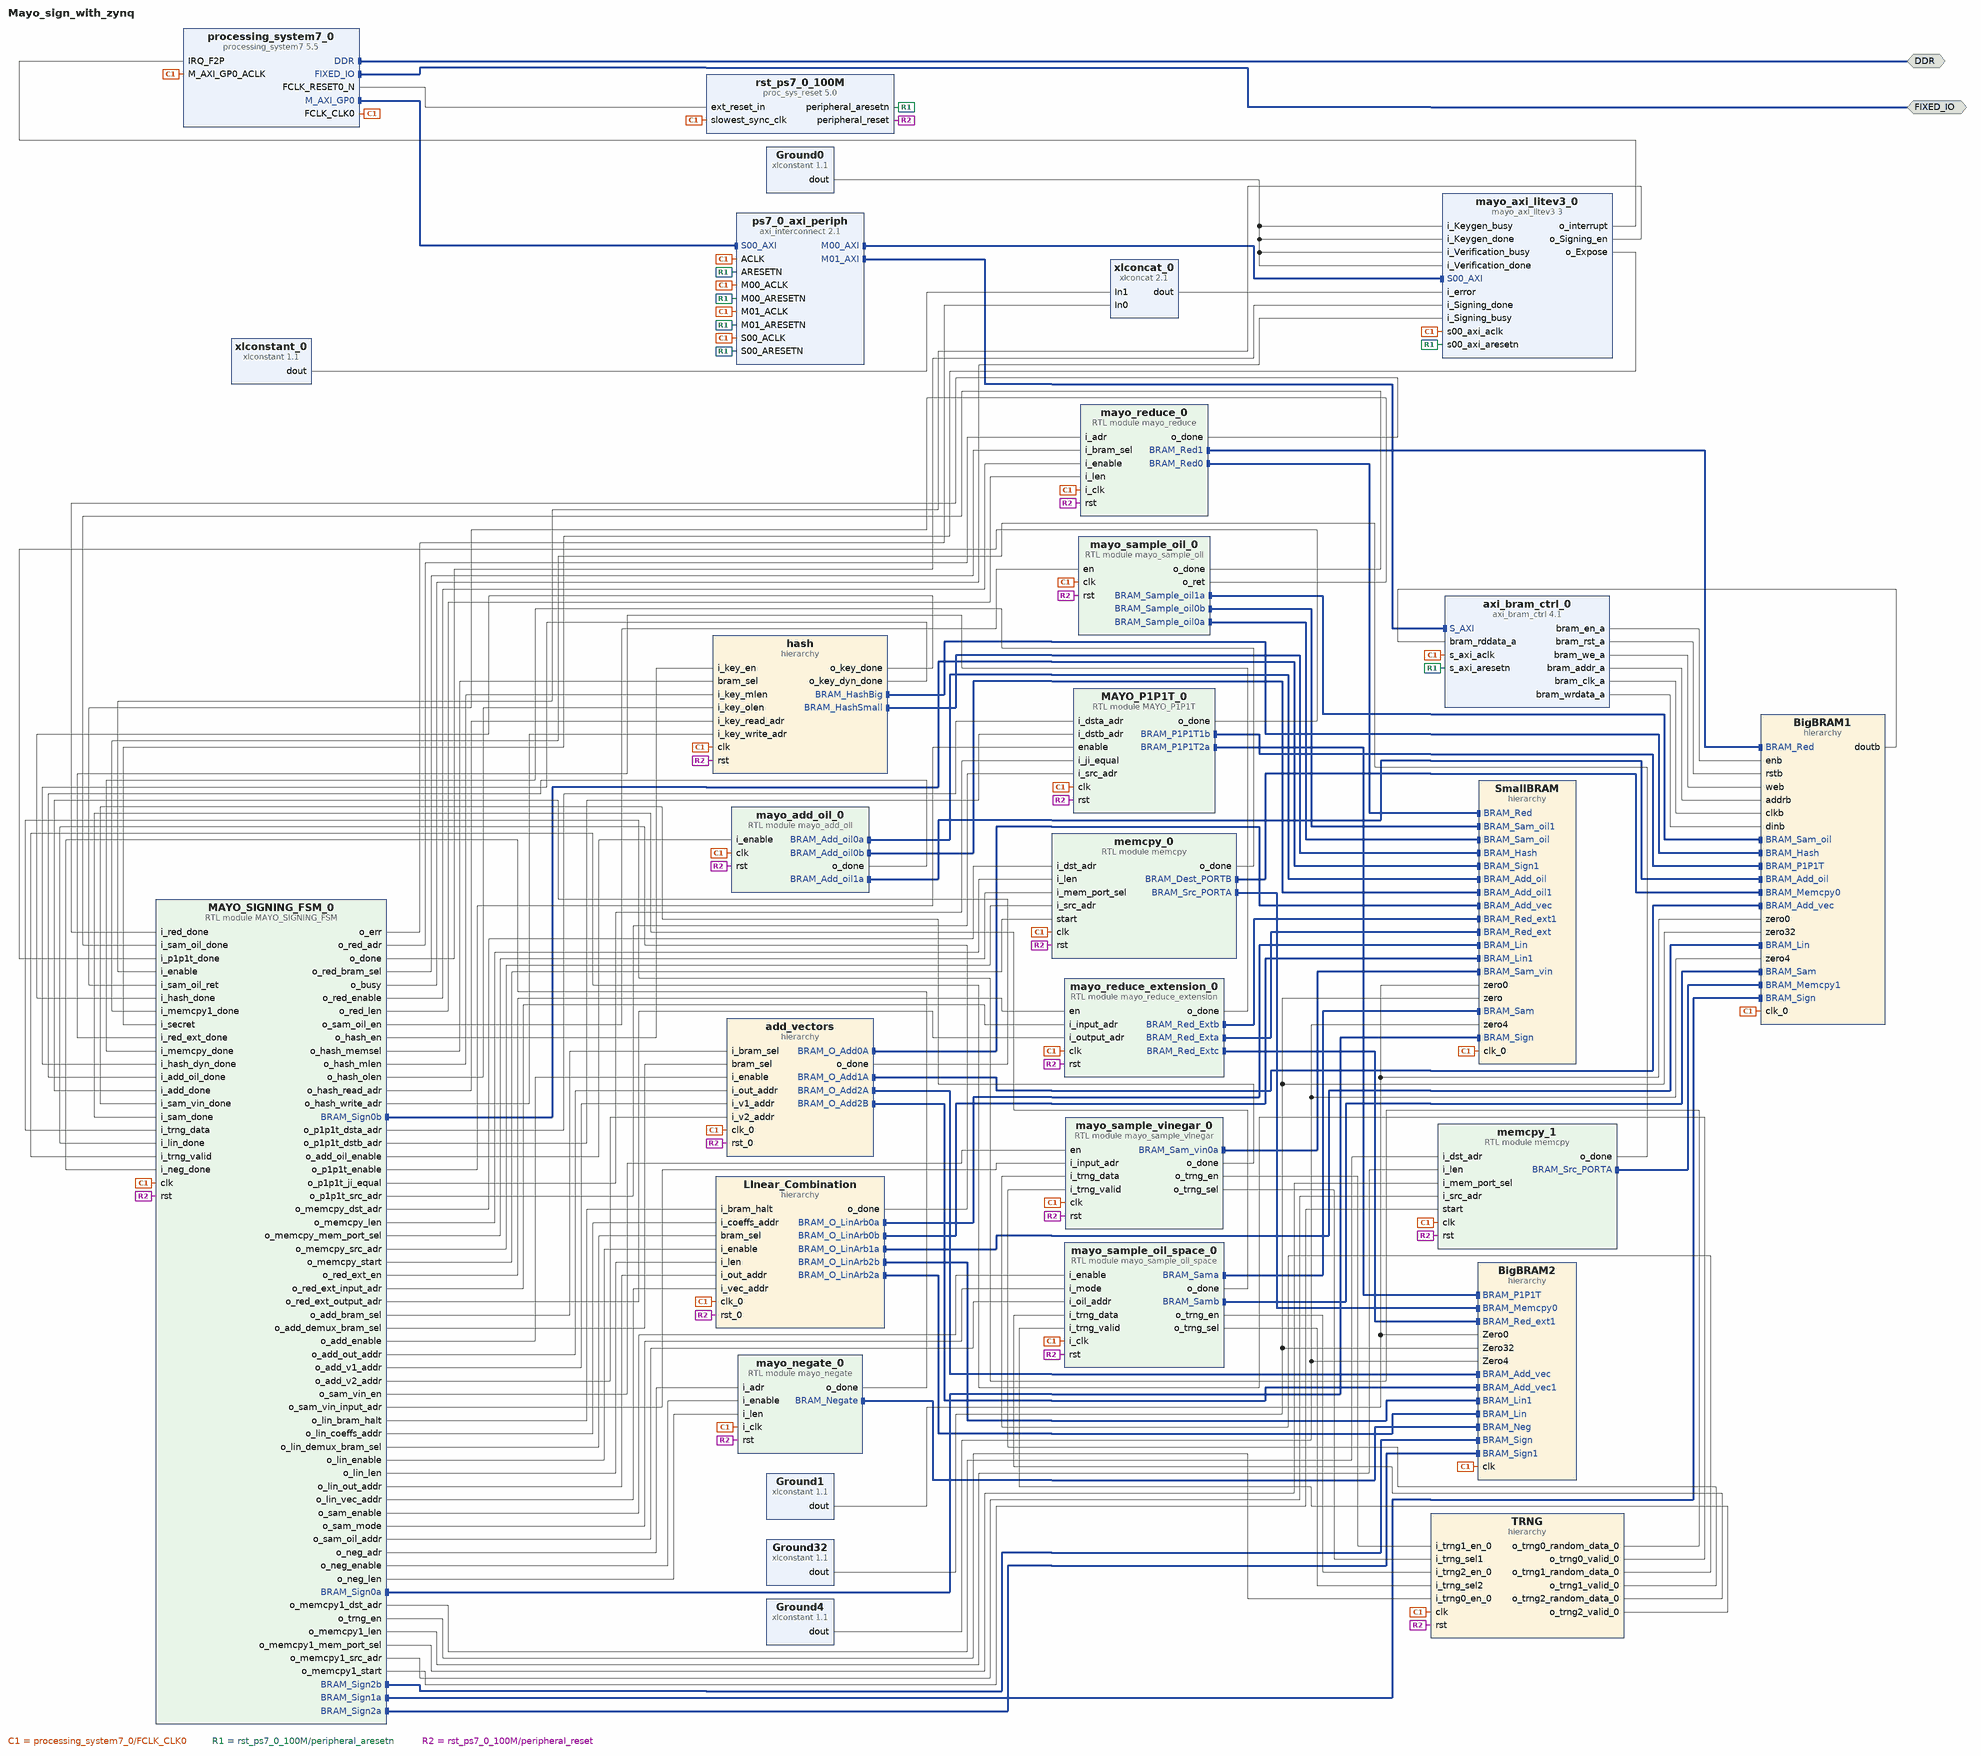
[diagram p0: block diagram of the top level]
# Vivado block design Mayo_sign_with_zynq, xc7z020clg484-1, Vivado 2020.2
create_bd_design Mayo_sign_with_zynq

create_bd_intf_port -mode Master -vlnv xilinx.com:interface:ddrx_rtl:1.0 DDR
create_bd_intf_port -mode Master -vlnv xilinx.com:display_processing_system7:fixedio_rtl:1.0 FIXED_IO

create_bd_cell -type ip -vlnv xilinx.com:ip:xlconstant:1.1 Ground0
set_property -dict {CONFIG.CONST_VAL 0} [get_bd_cells Ground0]
create_bd_cell -type ip -vlnv xilinx.com:ip:processing_system7:5.5 processing_system7_0
set_property -dict [list \
  CONFIG.PCW_APU_PERIPHERAL_FREQMHZ 666.666667 \
  CONFIG.PCW_ENET0_ENET0_IO {MIO 16 .. 27} \
  CONFIG.PCW_ENET0_GRP_MDIO_ENABLE 1 \
  CONFIG.PCW_ENET0_GRP_MDIO_IO {MIO 52 .. 53} \
  CONFIG.PCW_ENET0_PERIPHERAL_ENABLE 1 \
  CONFIG.PCW_ENET0_RESET_ENABLE 0 \
  CONFIG.PCW_ENET_RESET_ENABLE 1 \
  CONFIG.PCW_ENET_RESET_SELECT {Share reset pin} \
  CONFIG.PCW_FPGA0_PERIPHERAL_FREQMHZ 100 \
  CONFIG.PCW_FPGA1_PERIPHERAL_FREQMHZ 150.000000 \
  CONFIG.PCW_GPIO_MIO_GPIO_ENABLE 1 \
  CONFIG.PCW_GPIO_MIO_GPIO_IO MIO \
  CONFIG.PCW_I2C_RESET_ENABLE 1 \
  CONFIG.PCW_IRQ_F2P_INTR 1 \
  CONFIG.PCW_PRESET_BANK1_VOLTAGE {LVCMOS 1.8V} \
  CONFIG.PCW_QSPI_GRP_SINGLE_SS_ENABLE 1 \
  CONFIG.PCW_QSPI_GRP_SINGLE_SS_IO {MIO 1 .. 6} \
  CONFIG.PCW_QSPI_PERIPHERAL_ENABLE 1 \
  CONFIG.PCW_QSPI_QSPI_IO {MIO 1 .. 6} \
  CONFIG.PCW_SD0_GRP_CD_ENABLE 1 \
  CONFIG.PCW_SD0_GRP_CD_IO {MIO 47} \
  CONFIG.PCW_SD0_GRP_WP_ENABLE 1 \
  CONFIG.PCW_SD0_GRP_WP_IO {MIO 46} \
  CONFIG.PCW_SD0_PERIPHERAL_ENABLE 1 \
  CONFIG.PCW_SD0_SD0_IO {MIO 40 .. 45} \
  CONFIG.PCW_SDIO_PERIPHERAL_FREQMHZ 50 \
  CONFIG.PCW_SINGLE_QSPI_DATA_MODE x4 \
  CONFIG.PCW_TTC0_PERIPHERAL_ENABLE 1 \
  CONFIG.PCW_TTC0_TTC0_IO EMIO \
  CONFIG.PCW_UART1_PERIPHERAL_ENABLE 1 \
  CONFIG.PCW_UART1_UART1_IO {MIO 48 .. 49} \
  CONFIG.PCW_UART_PERIPHERAL_FREQMHZ 50 \
  CONFIG.PCW_UIPARAM_DDR_FREQ_MHZ 533.333313 \
  CONFIG.PCW_UIPARAM_DDR_PARTNO {MT41J128M16 HA-15E} \
  CONFIG.PCW_USB0_PERIPHERAL_ENABLE 1 \
  CONFIG.PCW_USB0_RESET_ENABLE 0 \
  CONFIG.PCW_USB0_USB0_IO {MIO 28 .. 39} \
  CONFIG.PCW_USB_RESET_ENABLE 1 \
  CONFIG.PCW_USB_RESET_SELECT {Share reset pin} \
  CONFIG.PCW_USE_FABRIC_INTERRUPT 1 \
  CONFIG.preset ZedBoard \
] [get_bd_cells processing_system7_0]
# 223 more settings of processing_system7_0 are not shown: defaults, MIO pin electricals, DDR timing, and values the tool derives
create_bd_cell -type ip -vlnv user.org:user:mayo_axi_litev3:3 mayo_axi_litev3_0
create_bd_cell -type ip -vlnv xilinx.com:ip:axi_interconnect:2.1 ps7_0_axi_periph
set_property -dict {CONFIG.NUM_MI 2} [get_bd_cells ps7_0_axi_periph]
create_bd_cell -type ip -vlnv xilinx.com:ip:proc_sys_reset:5.0 rst_ps7_0_100M
create_bd_cell -type ip -vlnv xilinx.com:ip:xlconcat:2.1 xlconcat_0
set_property -dict {CONFIG.IN0_WIDTH 2 CONFIG.IN1_WIDTH 6} [get_bd_cells xlconcat_0]
create_bd_cell -type ip -vlnv xilinx.com:ip:xlconstant:1.1 xlconstant_0
set_property -dict {CONFIG.CONST_VAL 0 CONFIG.CONST_WIDTH 6} [get_bd_cells xlconstant_0]
create_bd_cell -type hier BigBRAM1
create_bd_cell -type hier BigBRAM2
create_bd_cell -type ip -vlnv xilinx.com:ip:xlconstant:1.1 Ground1
set_property -dict {CONFIG.CONST_VAL 0} [get_bd_cells Ground1]
create_bd_cell -type ip -vlnv xilinx.com:ip:xlconstant:1.1 Ground32
set_property -dict {CONFIG.CONST_VAL 0x00000000 CONFIG.CONST_WIDTH 32} [get_bd_cells Ground32]
create_bd_cell -type ip -vlnv xilinx.com:ip:xlconstant:1.1 Ground4
set_property -dict {CONFIG.CONST_VAL 0000 CONFIG.CONST_WIDTH 4} [get_bd_cells Ground4]
create_bd_cell -type hier LInear_Combination
create_bd_cell -type module -reference MAYO_P1P1T MAYO_P1P1T_0
create_bd_cell -type module -reference MAYO_SIGNING_FSM MAYO_SIGNING_FSM_0
create_bd_cell -type hier SmallBRAM
create_bd_cell -type hier TRNG
create_bd_cell -type hier add_vectors
create_bd_cell -type hier hash
create_bd_cell -type module -reference mayo_add_oil mayo_add_oil_0
create_bd_cell -type module -reference mayo_negate mayo_negate_0
create_bd_cell -type module -reference mayo_reduce mayo_reduce_0
create_bd_cell -type module -reference mayo_reduce_extension mayo_reduce_extension_0
create_bd_cell -type module -reference mayo_sample_oil mayo_sample_oil_0
create_bd_cell -type module -reference mayo_sample_oil_space mayo_sample_oil_space_0
create_bd_cell -type module -reference memcpy memcpy_0
create_bd_cell -type module -reference memcpy memcpy_1
create_bd_cell -type ip -vlnv xilinx.com:ip:axi_bram_ctrl:4.1 axi_bram_ctrl_0
set_property -dict {CONFIG.SINGLE_PORT_BRAM 1} [get_bd_cells axi_bram_ctrl_0]
create_bd_cell -type module -reference mayo_sample_vinegar mayo_sample_vinegar_0

# ---- hierarchy /BigBRAM1 ----
current_bd_instance /BigBRAM1
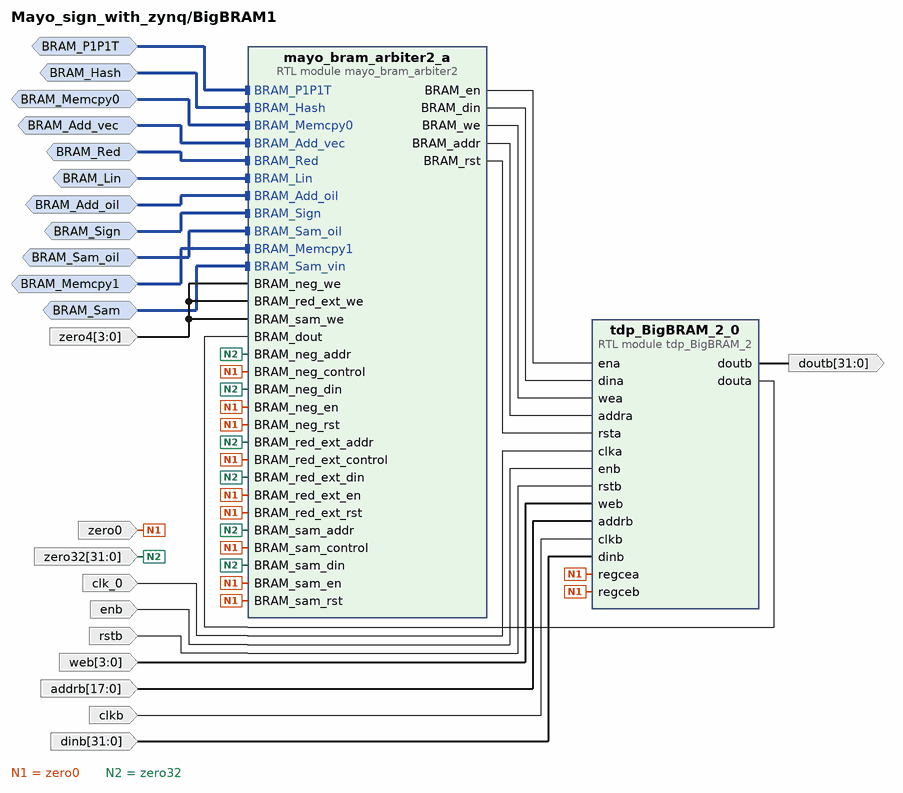
[diagram p1: block diagram inside /BigBRAM1]
create_bd_intf_pin -mode Slave -vlnv MAYO:user:BRAM_BUS_custom_rtl:1.0 BRAM_Sign
create_bd_intf_pin -mode Slave -vlnv MAYO:user:BRAM_BUS_custom_rtl:1.0 BRAM_Add_vec
create_bd_intf_pin -mode Slave -vlnv MAYO:user:BRAM_BUS_custom_rtl:1.0 BRAM_Lin
create_bd_intf_pin -mode Slave -vlnv MAYO:user:BRAM_BUS_custom_rtl:1.0 BRAM_Add_oil
create_bd_intf_pin -mode Slave -vlnv MAYO:user:BRAM_BUS_custom_rtl:1.0 BRAM_P1P1T
create_bd_intf_pin -mode Slave -vlnv MAYO:user:BRAM_BUS_custom_rtl:1.0 BRAM_Sam_oil
create_bd_intf_pin -mode Slave -vlnv MAYO:user:BRAM_BUS_custom_rtl:1.0 BRAM_Red
create_bd_intf_pin -mode Slave -vlnv MAYO:user:BRAM_BUS_custom_rtl:1.0 BRAM_Sam
create_bd_intf_pin -mode Slave -vlnv MAYO:user:BRAM_BUS_custom_rtl:1.0 BRAM_Memcpy0
create_bd_intf_pin -mode Slave -vlnv MAYO:user:BRAM_BUS_custom_rtl:1.0 BRAM_Memcpy1
create_bd_intf_pin -mode Slave -vlnv MAYO:user:BRAM_BUS_custom_rtl:1.0 BRAM_Hash
create_bd_pin -dir I -type clk clk_0
create_bd_pin -dir I zero0
create_bd_pin -dir I -from 3 -to 0 zero4
create_bd_pin -dir I -from 31 -to 0 zero32
create_bd_pin -dir I enb
create_bd_pin -dir I -type rst rstb
create_bd_pin -dir I -from 3 -to 0 web
create_bd_pin -dir I -from 17 -to 0 addrb
create_bd_pin -dir I -type clk clkb
create_bd_pin -dir O -from 31 -to 0 doutb
create_bd_pin -dir I -from 31 -to 0 dinb

create_bd_cell -type module -reference mayo_bram_arbiter2 mayo_bram_arbiter2_a
create_bd_cell -type module -reference tdp_BigBRAM_2 tdp_BigBRAM_2_0

# ---- hierarchy /BigBRAM2 ----
current_bd_instance /BigBRAM2
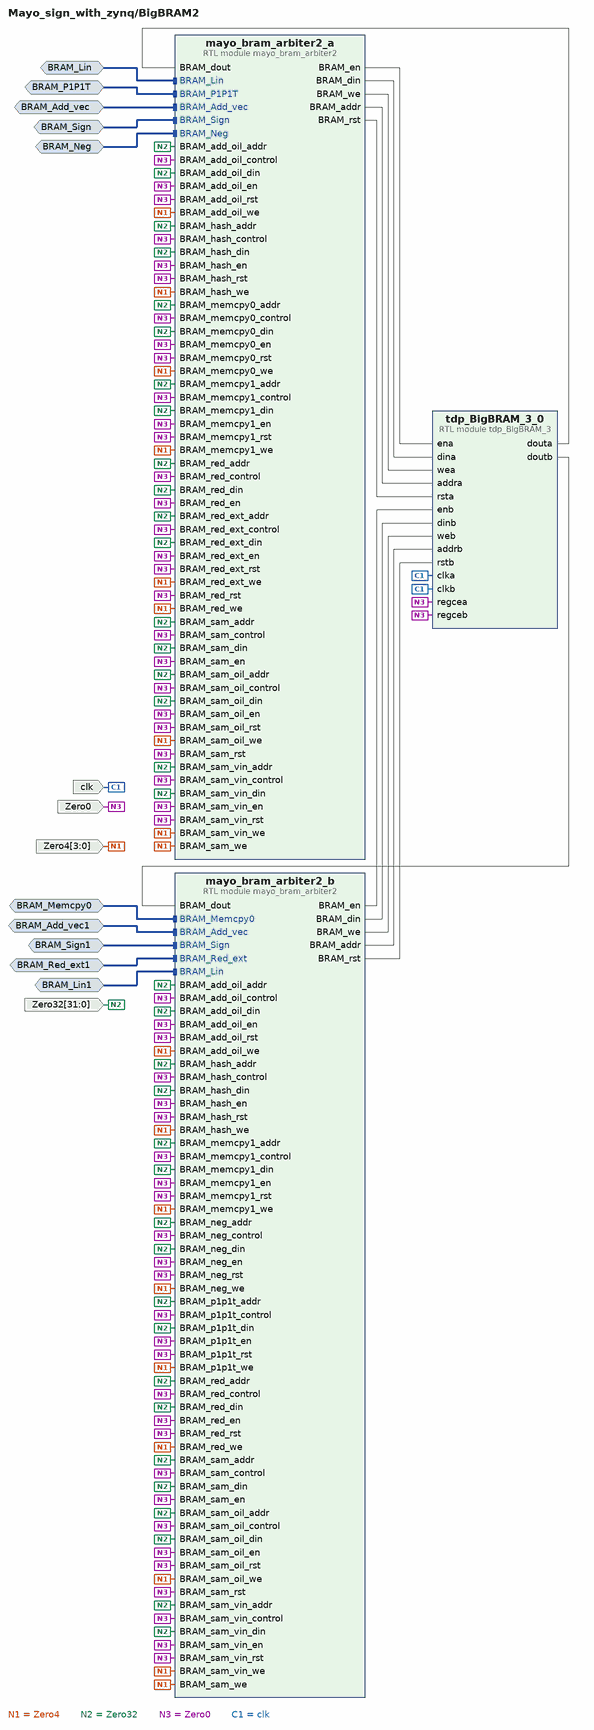
[diagram p2: block diagram inside /BigBRAM2]
create_bd_intf_pin -mode Slave -vlnv MAYO:user:BRAM_BUS_custom_rtl:1.0 BRAM_Lin
create_bd_intf_pin -mode Slave -vlnv MAYO:user:BRAM_BUS_custom_rtl:1.0 BRAM_Lin1
create_bd_intf_pin -mode Slave -vlnv MAYO:user:BRAM_BUS_custom_rtl:1.0 BRAM_Add_vec
create_bd_intf_pin -mode Slave -vlnv MAYO:user:BRAM_BUS_custom_rtl:1.0 BRAM_Add_vec1
create_bd_intf_pin -mode Slave -vlnv MAYO:user:BRAM_BUS_custom_rtl:1.0 BRAM_Sign
create_bd_intf_pin -mode Slave -vlnv MAYO:user:BRAM_BUS_custom_rtl:1.0 BRAM_Sign1
create_bd_intf_pin -mode Slave -vlnv MAYO:user:BRAM_BUS_custom_rtl:1.0 BRAM_Neg
create_bd_intf_pin -mode Slave -vlnv MAYO:user:BRAM_BUS_custom_rtl:1.0 BRAM_Memcpy0
create_bd_intf_pin -mode Slave -vlnv MAYO:user:BRAM_BUS_custom_rtl:1.0 BRAM_Red_ext1
create_bd_intf_pin -mode Slave -vlnv MAYO:user:BRAM_BUS_custom_rtl:1.0 BRAM_P1P1T
create_bd_pin -dir I -type clk clk
create_bd_pin -dir I Zero0
create_bd_pin -dir I -from 3 -to 0 Zero4
create_bd_pin -dir I -from 31 -to 0 Zero32

create_bd_cell -type module -reference mayo_bram_arbiter2 mayo_bram_arbiter2_b
create_bd_cell -type module -reference mayo_bram_arbiter2 mayo_bram_arbiter2_a
create_bd_cell -type module -reference tdp_BigBRAM_3 tdp_BigBRAM_3_0

# ---- hierarchy /LInear_Combination ----
current_bd_instance /LInear_Combination
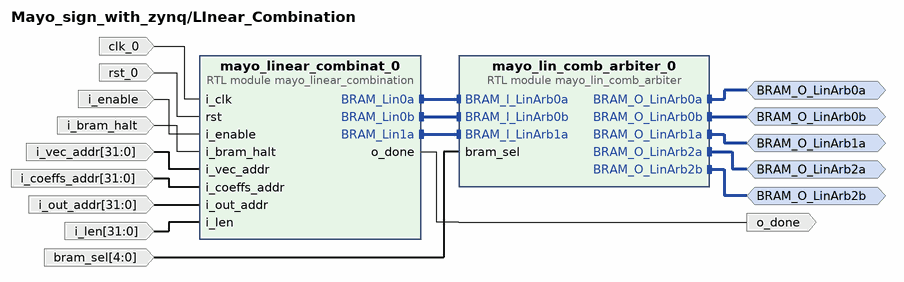
[diagram p3: block diagram inside /LInear_Combination]
create_bd_intf_pin -mode Master -vlnv MAYO:user:BRAM_BUS_custom_rtl:1.0 BRAM_O_LinArb0a
create_bd_intf_pin -mode Master -vlnv MAYO:user:BRAM_BUS_custom_rtl:1.0 BRAM_O_LinArb0b
create_bd_intf_pin -mode Master -vlnv MAYO:user:BRAM_BUS_custom_rtl:1.0 BRAM_O_LinArb1a
create_bd_intf_pin -mode Master -vlnv MAYO:user:BRAM_BUS_custom_rtl:1.0 BRAM_O_LinArb2a
create_bd_intf_pin -mode Master -vlnv MAYO:user:BRAM_BUS_custom_rtl:1.0 BRAM_O_LinArb2b
create_bd_pin -dir I -type clk clk_0
create_bd_pin -dir I -type rst rst_0
create_bd_pin -dir I i_enable
create_bd_pin -dir O o_done
create_bd_pin -dir I i_bram_halt
create_bd_pin -dir I -from 31 -to 0 i_vec_addr
create_bd_pin -dir I -from 31 -to 0 i_coeffs_addr
create_bd_pin -dir I -from 31 -to 0 i_out_addr
create_bd_pin -dir I -from 31 -to 0 i_len
create_bd_pin -dir I -from 4 -to 0 bram_sel

create_bd_cell -type module -reference mayo_lin_comb_arbiter mayo_lin_comb_arbiter_0
create_bd_cell -type module -reference mayo_linear_combination mayo_linear_combinat_0

# ---- hierarchy /SmallBRAM ----
current_bd_instance /SmallBRAM
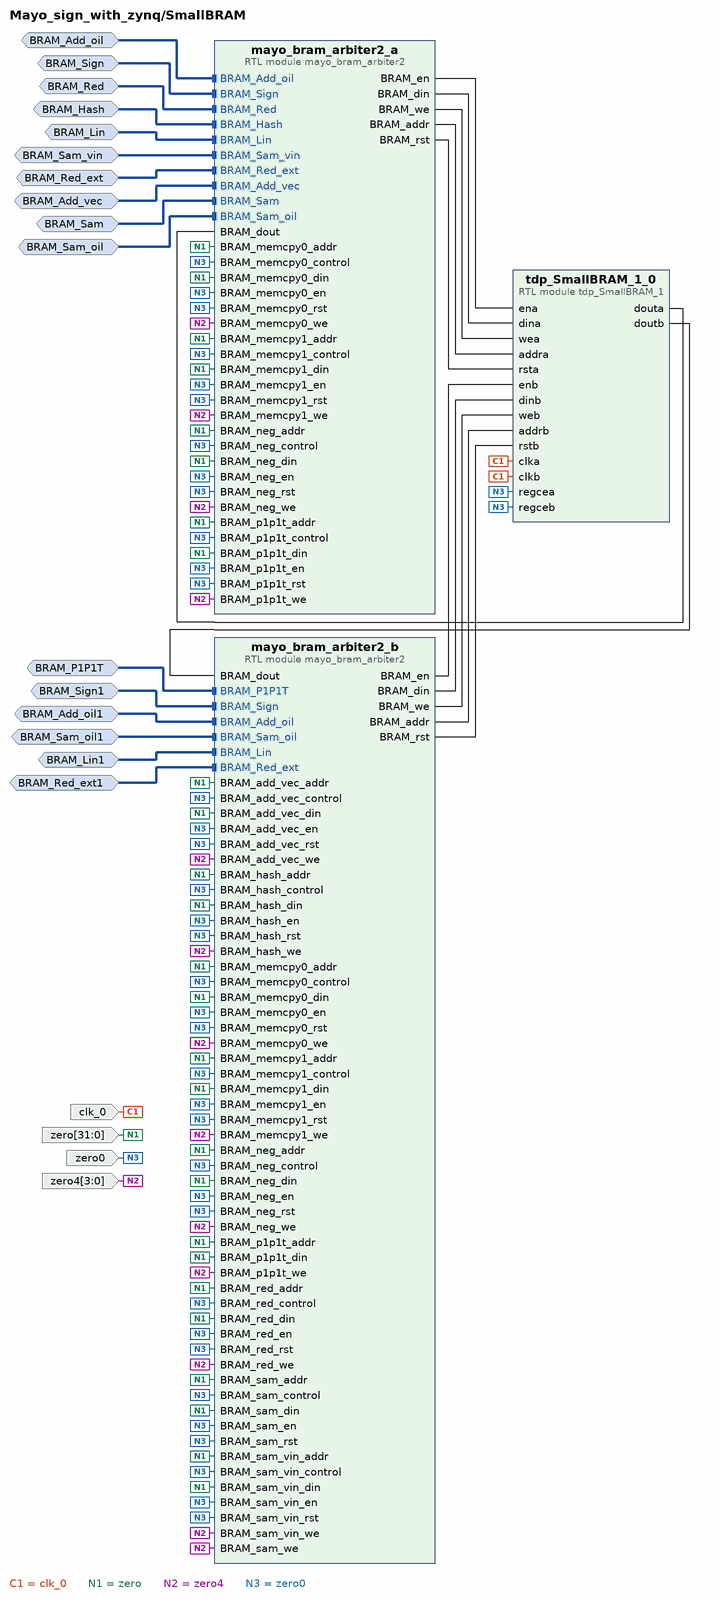
[diagram p4: block diagram inside /SmallBRAM]
create_bd_intf_pin -mode Slave -vlnv MAYO:user:BRAM_BUS_custom_rtl:1.0 BRAM_Sign
create_bd_intf_pin -mode Slave -vlnv MAYO:user:BRAM_BUS_custom_rtl:1.0 BRAM_Add_vec
create_bd_intf_pin -mode Slave -vlnv MAYO:user:BRAM_BUS_custom_rtl:1.0 BRAM_Sign1
create_bd_intf_pin -mode Slave -vlnv MAYO:user:BRAM_BUS_custom_rtl:1.0 BRAM_Lin
create_bd_intf_pin -mode Slave -vlnv MAYO:user:BRAM_BUS_custom_rtl:1.0 BRAM_Lin1
create_bd_intf_pin -mode Slave -vlnv MAYO:user:BRAM_BUS_custom_rtl:1.0 BRAM_Add_oil
create_bd_intf_pin -mode Slave -vlnv MAYO:user:BRAM_BUS_custom_rtl:1.0 BRAM_Add_oil1
create_bd_intf_pin -mode Slave -vlnv MAYO:user:BRAM_BUS_custom_rtl:1.0 BRAM_P1P1T
create_bd_intf_pin -mode Slave -vlnv MAYO:user:BRAM_BUS_custom_rtl:1.0 BRAM_Sam_oil
create_bd_intf_pin -mode Slave -vlnv MAYO:user:BRAM_BUS_custom_rtl:1.0 BRAM_Sam_oil1
create_bd_intf_pin -mode Slave -vlnv MAYO:user:BRAM_BUS_custom_rtl:1.0 BRAM_Sam_vin
create_bd_intf_pin -mode Slave -vlnv MAYO:user:BRAM_BUS_custom_rtl:1.0 BRAM_Red
create_bd_intf_pin -mode Slave -vlnv MAYO:user:BRAM_BUS_custom_rtl:1.0 BRAM_Sam
create_bd_intf_pin -mode Slave -vlnv MAYO:user:BRAM_BUS_custom_rtl:1.0 BRAM_Red_ext
create_bd_intf_pin -mode Slave -vlnv MAYO:user:BRAM_BUS_custom_rtl:1.0 BRAM_Red_ext1
create_bd_intf_pin -mode Slave -vlnv MAYO:user:BRAM_BUS_custom_rtl:1.0 BRAM_Hash
create_bd_pin -dir I -type clk clk_0
create_bd_pin -dir I -from 31 -to 0 zero
create_bd_pin -dir I -from 3 -to 0 zero4
create_bd_pin -dir I zero0

create_bd_cell -type module -reference mayo_bram_arbiter2 mayo_bram_arbiter2_a
create_bd_cell -type module -reference mayo_bram_arbiter2 mayo_bram_arbiter2_b
create_bd_cell -type module -reference tdp_SmallBRAM_1 tdp_SmallBRAM_1_0

# ---- hierarchy /TRNG ----
current_bd_instance /TRNG
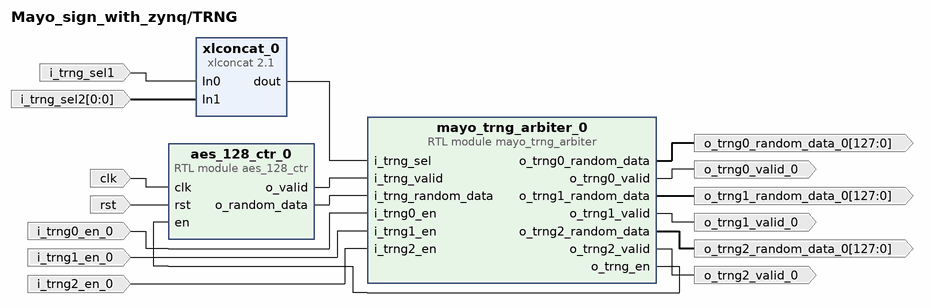
[diagram p5: block diagram inside /TRNG]
create_bd_pin -dir I clk
create_bd_pin -dir I rst
create_bd_pin -dir I i_trng_sel1
create_bd_pin -dir I -from 0 -to 0 i_trng_sel2
create_bd_pin -dir I i_trng0_en_0
create_bd_pin -dir I i_trng1_en_0
create_bd_pin -dir I i_trng2_en_0
create_bd_pin -dir O -from 127 -to 0 o_trng0_random_data_0
create_bd_pin -dir O o_trng0_valid_0
create_bd_pin -dir O -from 127 -to 0 o_trng1_random_data_0
create_bd_pin -dir O o_trng1_valid_0
create_bd_pin -dir O -from 127 -to 0 o_trng2_random_data_0
create_bd_pin -dir O o_trng2_valid_0

create_bd_cell -type ip -vlnv xilinx.com:ip:xlconcat:2.1 xlconcat_0
create_bd_cell -type module -reference mayo_trng_arbiter mayo_trng_arbiter_0
create_bd_cell -type module -reference aes_128_ctr aes_128_ctr_0

# ---- hierarchy /add_vectors ----
current_bd_instance /add_vectors
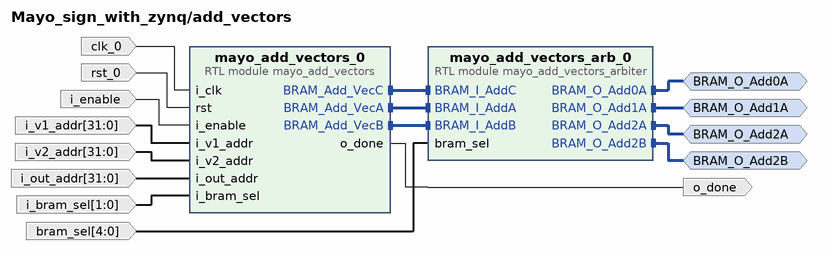
[diagram p6: block diagram inside /add_vectors]
create_bd_intf_pin -mode Master -vlnv MAYO:user:BRAM_BUS_custom_rtl:1.0 BRAM_O_Add0A
create_bd_intf_pin -mode Master -vlnv MAYO:user:BRAM_BUS_custom_rtl:1.0 BRAM_O_Add1A
create_bd_intf_pin -mode Master -vlnv MAYO:user:BRAM_BUS_custom_rtl:1.0 BRAM_O_Add2A
create_bd_intf_pin -mode Master -vlnv MAYO:user:BRAM_BUS_custom_rtl:1.0 BRAM_O_Add2B
create_bd_pin -dir I -type clk clk_0
create_bd_pin -dir I -type rst rst_0
create_bd_pin -dir I i_enable
create_bd_pin -dir I -from 31 -to 0 i_v1_addr
create_bd_pin -dir I -from 31 -to 0 i_v2_addr
create_bd_pin -dir I -from 31 -to 0 i_out_addr
create_bd_pin -dir I -from 1 -to 0 i_bram_sel
create_bd_pin -dir O o_done
create_bd_pin -dir I -from 4 -to 0 bram_sel

create_bd_cell -type module -reference mayo_add_vectors mayo_add_vectors_0
create_bd_cell -type module -reference mayo_add_vectors_arbiter mayo_add_vectors_arb_0

# ---- hierarchy /hash ----
current_bd_instance /hash
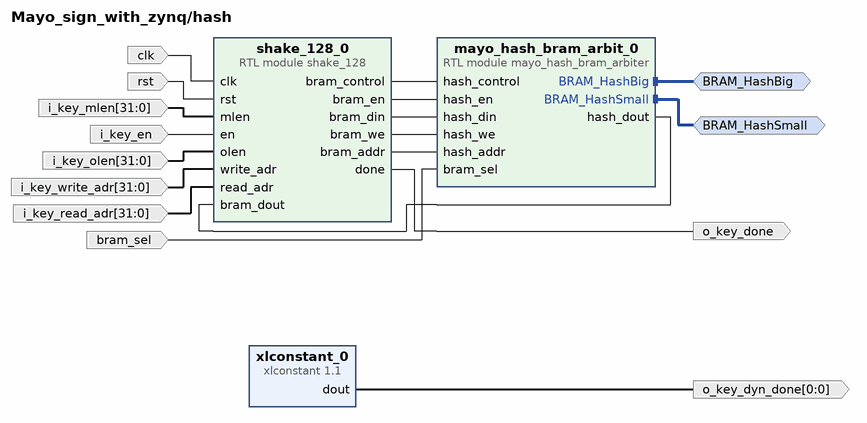
[diagram p7: block diagram inside /hash]
create_bd_intf_pin -mode Master -vlnv MAYO:user:BRAM_BUS_custom_rtl:1.0 BRAM_HashSmall
create_bd_intf_pin -mode Master -vlnv MAYO:user:BRAM_BUS_custom_rtl:1.0 BRAM_HashBig
create_bd_pin -dir I -type clk clk
create_bd_pin -dir I -type rst rst
create_bd_pin -dir I i_key_en
create_bd_pin -dir I -from 31 -to 0 i_key_mlen
create_bd_pin -dir I -from 31 -to 0 i_key_olen
create_bd_pin -dir I -from 31 -to 0 i_key_write_adr
create_bd_pin -dir I -from 31 -to 0 i_key_read_adr
create_bd_pin -dir O o_key_done
create_bd_pin -dir O -from 0 -to 0 o_key_dyn_done
create_bd_pin -dir I bram_sel

create_bd_cell -type module -reference mayo_hash_bram_arbiter mayo_hash_bram_arbit_0
create_bd_cell -type ip -vlnv xilinx.com:ip:xlconstant:1.1 xlconstant_0
set_property -dict {CONFIG.CONST_VAL 0} [get_bd_cells xlconstant_0]
create_bd_cell -type module -reference shake_128 shake_128_0

# ---- connections ----

current_bd_instance /BigBRAM1
connect_bd_intf_net [get_bd_intf_pins BRAM_P1P1T] [get_bd_intf_pins mayo_bram_arbiter2_a/BRAM_P1P1T]
connect_bd_intf_net [get_bd_intf_pins BRAM_Hash] [get_bd_intf_pins mayo_bram_arbiter2_a/BRAM_Hash]
connect_bd_intf_net [get_bd_intf_pins BRAM_Memcpy0] [get_bd_intf_pins mayo_bram_arbiter2_a/BRAM_Memcpy0]
connect_bd_intf_net [get_bd_intf_pins BRAM_Add_vec] [get_bd_intf_pins mayo_bram_arbiter2_a/BRAM_Add_vec]
connect_bd_intf_net [get_bd_intf_pins BRAM_Red] [get_bd_intf_pins mayo_bram_arbiter2_a/BRAM_Red]
connect_bd_intf_net [get_bd_intf_pins BRAM_Lin] [get_bd_intf_pins mayo_bram_arbiter2_a/BRAM_Lin]
connect_bd_intf_net [get_bd_intf_pins BRAM_Add_oil] [get_bd_intf_pins mayo_bram_arbiter2_a/BRAM_Add_oil]
connect_bd_intf_net [get_bd_intf_pins BRAM_Sign] [get_bd_intf_pins mayo_bram_arbiter2_a/BRAM_Sign]
connect_bd_intf_net [get_bd_intf_pins BRAM_Sam_oil] [get_bd_intf_pins mayo_bram_arbiter2_a/BRAM_Sam_oil]
connect_bd_intf_net [get_bd_intf_pins BRAM_Memcpy1] [get_bd_intf_pins mayo_bram_arbiter2_a/BRAM_Memcpy1]
connect_bd_intf_net [get_bd_intf_pins BRAM_Sam] [get_bd_intf_pins mayo_bram_arbiter2_a/BRAM_Sam_vin]
connect_bd_net [get_bd_pins mayo_bram_arbiter2_a/BRAM_en] [get_bd_pins tdp_BigBRAM_2_0/ena]
connect_bd_net [get_bd_pins tdp_BigBRAM_2_0/douta] [get_bd_pins mayo_bram_arbiter2_a/BRAM_dout]
connect_bd_net [get_bd_pins mayo_bram_arbiter2_a/BRAM_din] [get_bd_pins tdp_BigBRAM_2_0/dina]
connect_bd_net [get_bd_pins mayo_bram_arbiter2_a/BRAM_we] [get_bd_pins tdp_BigBRAM_2_0/wea]
connect_bd_net [get_bd_pins mayo_bram_arbiter2_a/BRAM_addr] [get_bd_pins tdp_BigBRAM_2_0/addra]
connect_bd_net [get_bd_pins mayo_bram_arbiter2_a/BRAM_rst] [get_bd_pins tdp_BigBRAM_2_0/rsta]
connect_bd_net -net zero0_1 [get_bd_pins zero0] \
  [get_bd_pins tdp_BigBRAM_2_0/regcea] [get_bd_pins tdp_BigBRAM_2_0/regceb] [get_bd_pins mayo_bram_arbiter2_a/BRAM_neg_en] \
  [get_bd_pins mayo_bram_arbiter2_a/BRAM_neg_rst] [get_bd_pins mayo_bram_arbiter2_a/BRAM_neg_control] \
  [get_bd_pins mayo_bram_arbiter2_a/BRAM_sam_en] [get_bd_pins mayo_bram_arbiter2_a/BRAM_sam_rst] \
  [get_bd_pins mayo_bram_arbiter2_a/BRAM_sam_control] [get_bd_pins mayo_bram_arbiter2_a/BRAM_red_ext_en] \
  [get_bd_pins mayo_bram_arbiter2_a/BRAM_red_ext_control] [get_bd_pins mayo_bram_arbiter2_a/BRAM_red_ext_rst]
connect_bd_net -net zero4_1 [get_bd_pins zero4] \
  [get_bd_pins mayo_bram_arbiter2_a/BRAM_neg_we] [get_bd_pins mayo_bram_arbiter2_a/BRAM_sam_we] \
  [get_bd_pins mayo_bram_arbiter2_a/BRAM_red_ext_we]
connect_bd_net -net zero32_1 [get_bd_pins zero32] \
  [get_bd_pins mayo_bram_arbiter2_a/BRAM_neg_din] [get_bd_pins mayo_bram_arbiter2_a/BRAM_neg_addr] \
  [get_bd_pins mayo_bram_arbiter2_a/BRAM_sam_din] [get_bd_pins mayo_bram_arbiter2_a/BRAM_sam_addr] \
  [get_bd_pins mayo_bram_arbiter2_a/BRAM_red_ext_addr] [get_bd_pins mayo_bram_arbiter2_a/BRAM_red_ext_din]
connect_bd_net -net clk_0_1 [get_bd_pins clk_0] [get_bd_pins tdp_BigBRAM_2_0/clka]
connect_bd_net [get_bd_pins enb] [get_bd_pins tdp_BigBRAM_2_0/enb]
connect_bd_net [get_bd_pins rstb] [get_bd_pins tdp_BigBRAM_2_0/rstb]
connect_bd_net [get_bd_pins web] [get_bd_pins tdp_BigBRAM_2_0/web]
connect_bd_net [get_bd_pins addrb] [get_bd_pins tdp_BigBRAM_2_0/addrb]
connect_bd_net [get_bd_pins clkb] [get_bd_pins tdp_BigBRAM_2_0/clkb]
connect_bd_net [get_bd_pins tdp_BigBRAM_2_0/doutb] [get_bd_pins doutb]
connect_bd_net [get_bd_pins dinb] [get_bd_pins tdp_BigBRAM_2_0/dinb]

current_bd_instance /BigBRAM2
connect_bd_intf_net [get_bd_intf_pins BRAM_Lin] [get_bd_intf_pins mayo_bram_arbiter2_a/BRAM_Lin]
connect_bd_intf_net [get_bd_intf_pins BRAM_P1P1T] [get_bd_intf_pins mayo_bram_arbiter2_a/BRAM_P1P1T]
connect_bd_intf_net [get_bd_intf_pins BRAM_Add_vec] [get_bd_intf_pins mayo_bram_arbiter2_a/BRAM_Add_vec]
connect_bd_intf_net [get_bd_intf_pins BRAM_Memcpy0] [get_bd_intf_pins mayo_bram_arbiter2_b/BRAM_Memcpy0]
connect_bd_intf_net [get_bd_intf_pins BRAM_Add_vec1] [get_bd_intf_pins mayo_bram_arbiter2_b/BRAM_Add_vec]
connect_bd_intf_net [get_bd_intf_pins BRAM_Sign1] [get_bd_intf_pins mayo_bram_arbiter2_b/BRAM_Sign]
connect_bd_intf_net [get_bd_intf_pins BRAM_Sign] [get_bd_intf_pins mayo_bram_arbiter2_a/BRAM_Sign]
connect_bd_intf_net [get_bd_intf_pins BRAM_Red_ext1] [get_bd_intf_pins mayo_bram_arbiter2_b/BRAM_Red_ext]
connect_bd_intf_net [get_bd_intf_pins BRAM_Neg] [get_bd_intf_pins mayo_bram_arbiter2_a/BRAM_Neg]
connect_bd_intf_net [get_bd_intf_pins BRAM_Lin1] [get_bd_intf_pins mayo_bram_arbiter2_b/BRAM_Lin]
connect_bd_net -net BRAM_neg_we1_1 [get_bd_pins Zero4] \
  [get_bd_pins mayo_bram_arbiter2_b/BRAM_neg_we] [get_bd_pins mayo_bram_arbiter2_b/BRAM_red_we] \
  [get_bd_pins mayo_bram_arbiter2_b/BRAM_sam_we] [get_bd_pins mayo_bram_arbiter2_b/BRAM_memcpy1_we] \
  [get_bd_pins mayo_bram_arbiter2_b/BRAM_p1p1t_we] [get_bd_pins mayo_bram_arbiter2_b/BRAM_sam_vin_we] \
  [get_bd_pins mayo_bram_arbiter2_b/BRAM_sam_oil_we] [get_bd_pins mayo_bram_arbiter2_b/BRAM_add_oil_we] \
  [get_bd_pins mayo_bram_arbiter2_b/BRAM_hash_we] [get_bd_pins mayo_bram_arbiter2_a/BRAM_red_we] \
  [get_bd_pins mayo_bram_arbiter2_a/BRAM_sam_we] [get_bd_pins mayo_bram_arbiter2_a/BRAM_memcpy0_we] \
  [get_bd_pins mayo_bram_arbiter2_a/BRAM_memcpy1_we] [get_bd_pins mayo_bram_arbiter2_a/BRAM_red_ext_we] \
  [get_bd_pins mayo_bram_arbiter2_a/BRAM_sam_vin_we] [get_bd_pins mayo_bram_arbiter2_a/BRAM_sam_oil_we] \
  [get_bd_pins mayo_bram_arbiter2_a/BRAM_add_oil_we] [get_bd_pins mayo_bram_arbiter2_a/BRAM_hash_we]
connect_bd_net -net BRAM_neg_din1_1 [get_bd_pins Zero32] \
  [get_bd_pins mayo_bram_arbiter2_b/BRAM_neg_din] [get_bd_pins mayo_bram_arbiter2_b/BRAM_neg_addr] \
  [get_bd_pins mayo_bram_arbiter2_b/BRAM_red_din] [get_bd_pins mayo_bram_arbiter2_b/BRAM_red_addr] \
  [get_bd_pins mayo_bram_arbiter2_b/BRAM_sam_din] [get_bd_pins mayo_bram_arbiter2_b/BRAM_sam_addr] \
  [get_bd_pins mayo_bram_arbiter2_b/BRAM_memcpy1_din] [get_bd_pins mayo_bram_arbiter2_b/BRAM_memcpy1_addr] \
  [get_bd_pins mayo_bram_arbiter2_b/BRAM_p1p1t_din] [get_bd_pins mayo_bram_arbiter2_b/BRAM_p1p1t_addr] \
  [get_bd_pins mayo_bram_arbiter2_b/BRAM_sam_vin_din] [get_bd_pins mayo_bram_arbiter2_b/BRAM_sam_vin_addr] \
  [get_bd_pins mayo_bram_arbiter2_b/BRAM_sam_oil_din] [get_bd_pins mayo_bram_arbiter2_b/BRAM_sam_oil_addr] \
  [get_bd_pins mayo_bram_arbiter2_b/BRAM_add_oil_din] [get_bd_pins mayo_bram_arbiter2_b/BRAM_add_oil_addr] \
  [get_bd_pins mayo_bram_arbiter2_b/BRAM_hash_din] [get_bd_pins mayo_bram_arbiter2_b/BRAM_hash_addr] \
  [get_bd_pins mayo_bram_arbiter2_a/BRAM_red_din] [get_bd_pins mayo_bram_arbiter2_a/BRAM_red_addr] \
  [get_bd_pins mayo_bram_arbiter2_a/BRAM_sam_din] [get_bd_pins mayo_bram_arbiter2_a/BRAM_sam_addr] \
  [get_bd_pins mayo_bram_arbiter2_a/BRAM_memcpy0_din] [get_bd_pins mayo_bram_arbiter2_a/BRAM_memcpy0_addr] \
  [get_bd_pins mayo_bram_arbiter2_a/BRAM_memcpy1_din] [get_bd_pins mayo_bram_arbiter2_a/BRAM_memcpy1_addr] \
  [get_bd_pins mayo_bram_arbiter2_a/BRAM_red_ext_din] [get_bd_pins mayo_bram_arbiter2_a/BRAM_red_ext_addr] \
  [get_bd_pins mayo_bram_arbiter2_a/BRAM_sam_vin_din] [get_bd_pins mayo_bram_arbiter2_a/BRAM_sam_vin_addr] \
  [get_bd_pins mayo_bram_arbiter2_a/BRAM_sam_oil_din] [get_bd_pins mayo_bram_arbiter2_a/BRAM_sam_oil_addr] \
  [get_bd_pins mayo_bram_arbiter2_a/BRAM_add_oil_din] [get_bd_pins mayo_bram_arbiter2_a/BRAM_add_oil_addr] \
  [get_bd_pins mayo_bram_arbiter2_a/BRAM_hash_din] [get_bd_pins mayo_bram_arbiter2_a/BRAM_hash_addr]
connect_bd_net -net BRAM_neg_en1_1 [get_bd_pins Zero0] \
  [get_bd_pins mayo_bram_arbiter2_b/BRAM_neg_en] [get_bd_pins mayo_bram_arbiter2_b/BRAM_neg_rst] \
  [get_bd_pins mayo_bram_arbiter2_b/BRAM_neg_control] [get_bd_pins mayo_bram_arbiter2_b/BRAM_red_en] \
  [get_bd_pins mayo_bram_arbiter2_b/BRAM_red_rst] [get_bd_pins mayo_bram_arbiter2_b/BRAM_red_control] \
  [get_bd_pins mayo_bram_arbiter2_b/BRAM_sam_en] [get_bd_pins mayo_bram_arbiter2_b/BRAM_sam_rst] \
  [get_bd_pins mayo_bram_arbiter2_b/BRAM_sam_control] [get_bd_pins mayo_bram_arbiter2_b/BRAM_memcpy1_en] \
  [get_bd_pins mayo_bram_arbiter2_b/BRAM_memcpy1_rst] [get_bd_pins mayo_bram_arbiter2_b/BRAM_memcpy1_control] \
  [get_bd_pins mayo_bram_arbiter2_b/BRAM_p1p1t_en] [get_bd_pins mayo_bram_arbiter2_b/BRAM_p1p1t_rst] \
  [get_bd_pins mayo_bram_arbiter2_b/BRAM_p1p1t_control] [get_bd_pins mayo_bram_arbiter2_b/BRAM_sam_vin_en] \
  [get_bd_pins mayo_bram_arbiter2_b/BRAM_sam_vin_rst] [get_bd_pins mayo_bram_arbiter2_b/BRAM_sam_vin_control] \
  [get_bd_pins mayo_bram_arbiter2_b/BRAM_sam_oil_en] [get_bd_pins mayo_bram_arbiter2_b/BRAM_sam_oil_rst] \
  [get_bd_pins mayo_bram_arbiter2_b/BRAM_sam_oil_control] [get_bd_pins mayo_bram_arbiter2_b/BRAM_add_oil_en] \
  [get_bd_pins mayo_bram_arbiter2_b/BRAM_add_oil_rst] [get_bd_pins mayo_bram_arbiter2_b/BRAM_add_oil_control] \
  [get_bd_pins mayo_bram_arbiter2_b/BRAM_hash_en] [get_bd_pins mayo_bram_arbiter2_b/BRAM_hash_rst] \
  [get_bd_pins mayo_bram_arbiter2_b/BRAM_hash_control] [get_bd_pins mayo_bram_arbiter2_a/BRAM_red_en] \
  [get_bd_pins mayo_bram_arbiter2_a/BRAM_red_rst] [get_bd_pins mayo_bram_arbiter2_a/BRAM_red_control] \
  [get_bd_pins mayo_bram_arbiter2_a/BRAM_sam_en] [get_bd_pins mayo_bram_arbiter2_a/BRAM_sam_rst] \
  [get_bd_pins mayo_bram_arbiter2_a/BRAM_sam_control] [get_bd_pins mayo_bram_arbiter2_a/BRAM_memcpy0_en] \
  [get_bd_pins mayo_bram_arbiter2_a/BRAM_memcpy0_rst] [get_bd_pins mayo_bram_arbiter2_a/BRAM_memcpy0_control] \
  [get_bd_pins mayo_bram_arbiter2_a/BRAM_memcpy1_en] [get_bd_pins mayo_bram_arbiter2_a/BRAM_memcpy1_rst] \
  [get_bd_pins mayo_bram_arbiter2_a/BRAM_memcpy1_control] [get_bd_pins mayo_bram_arbiter2_a/BRAM_red_ext_en] \
  [get_bd_pins mayo_bram_arbiter2_a/BRAM_red_ext_rst] [get_bd_pins mayo_bram_arbiter2_a/BRAM_red_ext_control] \
  [get_bd_pins mayo_bram_arbiter2_a/BRAM_sam_vin_en] [get_bd_pins mayo_bram_arbiter2_a/BRAM_sam_vin_rst] \
  [get_bd_pins mayo_bram_arbiter2_a/BRAM_sam_vin_control] [get_bd_pins mayo_bram_arbiter2_a/BRAM_sam_oil_en] \
  [get_bd_pins mayo_bram_arbiter2_a/BRAM_sam_oil_rst] [get_bd_pins mayo_bram_arbiter2_a/BRAM_sam_oil_control] \
  [get_bd_pins mayo_bram_arbiter2_a/BRAM_add_oil_en] [get_bd_pins mayo_bram_arbiter2_a/BRAM_add_oil_rst] \
  [get_bd_pins mayo_bram_arbiter2_a/BRAM_add_oil_control] [get_bd_pins mayo_bram_arbiter2_a/BRAM_hash_en] \
  [get_bd_pins mayo_bram_arbiter2_a/BRAM_hash_rst] [get_bd_pins mayo_bram_arbiter2_a/BRAM_hash_control] \
  [get_bd_pins tdp_BigBRAM_3_0/regcea] [get_bd_pins tdp_BigBRAM_3_0/regceb]
connect_bd_net [get_bd_pins mayo_bram_arbiter2_a/BRAM_en] [get_bd_pins tdp_BigBRAM_3_0/ena]
connect_bd_net [get_bd_pins tdp_BigBRAM_3_0/douta] [get_bd_pins mayo_bram_arbiter2_a/BRAM_dout]
connect_bd_net [get_bd_pins mayo_bram_arbiter2_a/BRAM_din] [get_bd_pins tdp_BigBRAM_3_0/dina]
connect_bd_net [get_bd_pins mayo_bram_arbiter2_a/BRAM_we] [get_bd_pins tdp_BigBRAM_3_0/wea]
connect_bd_net [get_bd_pins mayo_bram_arbiter2_a/BRAM_addr] [get_bd_pins tdp_BigBRAM_3_0/addra]
connect_bd_net [get_bd_pins mayo_bram_arbiter2_a/BRAM_rst] [get_bd_pins tdp_BigBRAM_3_0/rsta]
connect_bd_net [get_bd_pins mayo_bram_arbiter2_b/BRAM_en] [get_bd_pins tdp_BigBRAM_3_0/enb]
connect_bd_net [get_bd_pins tdp_BigBRAM_3_0/doutb] [get_bd_pins mayo_bram_arbiter2_b/BRAM_dout]
connect_bd_net [get_bd_pins mayo_bram_arbiter2_b/BRAM_din] [get_bd_pins tdp_BigBRAM_3_0/dinb]
connect_bd_net [get_bd_pins mayo_bram_arbiter2_b/BRAM_we] [get_bd_pins tdp_BigBRAM_3_0/web]
connect_bd_net [get_bd_pins mayo_bram_arbiter2_b/BRAM_addr] [get_bd_pins tdp_BigBRAM_3_0/addrb]
connect_bd_net [get_bd_pins mayo_bram_arbiter2_b/BRAM_rst] [get_bd_pins tdp_BigBRAM_3_0/rstb]
connect_bd_net [get_bd_pins clk] [get_bd_pins tdp_BigBRAM_3_0/clka] [get_bd_pins tdp_BigBRAM_3_0/clkb]

current_bd_instance /LInear_Combination
connect_bd_intf_net [get_bd_intf_pins mayo_linear_combinat_0/BRAM_Lin0a] [get_bd_intf_pins mayo_lin_comb_arbiter_0/BRAM_I_LinArb0a]
connect_bd_intf_net [get_bd_intf_pins mayo_linear_combinat_0/BRAM_Lin0b] [get_bd_intf_pins mayo_lin_comb_arbiter_0/BRAM_I_LinArb0b]
connect_bd_intf_net [get_bd_intf_pins BRAM_O_LinArb0b] [get_bd_intf_pins mayo_lin_comb_arbiter_0/BRAM_O_LinArb0b]
connect_bd_intf_net [get_bd_intf_pins mayo_linear_combinat_0/BRAM_Lin1a] [get_bd_intf_pins mayo_lin_comb_arbiter_0/BRAM_I_LinArb1a]
connect_bd_intf_net [get_bd_intf_pins BRAM_O_LinArb2a] [get_bd_intf_pins mayo_lin_comb_arbiter_0/BRAM_O_LinArb2a]
connect_bd_intf_net [get_bd_intf_pins BRAM_O_LinArb0a] [get_bd_intf_pins mayo_lin_comb_arbiter_0/BRAM_O_LinArb0a]
connect_bd_intf_net [get_bd_intf_pins BRAM_O_LinArb2b] [get_bd_intf_pins mayo_lin_comb_arbiter_0/BRAM_O_LinArb2b]
connect_bd_intf_net [get_bd_intf_pins BRAM_O_LinArb1a] [get_bd_intf_pins mayo_lin_comb_arbiter_0/BRAM_O_LinArb1a]
connect_bd_net -net clk_0_1 [get_bd_pins clk_0] [get_bd_pins mayo_linear_combinat_0/i_clk]
connect_bd_net -net rst_0_1 [get_bd_pins rst_0] [get_bd_pins mayo_linear_combinat_0/rst]
connect_bd_net -net MAYO_SIGNING_FSM_0_o_lin_enable [get_bd_pins i_enable] [get_bd_pins mayo_linear_combinat_0/i_enable]
connect_bd_net [get_bd_pins mayo_linear_combinat_0/o_done] [get_bd_pins o_done]
connect_bd_net -net MAYO_SIGNING_FSM_0_o_lin_bram_halt [get_bd_pins i_bram_halt] [get_bd_pins mayo_linear_combinat_0/i_bram_halt]
connect_bd_net -net MAYO_SIGNING_FSM_0_o_lin_vec_addr [get_bd_pins i_vec_addr] [get_bd_pins mayo_linear_combinat_0/i_vec_addr]
connect_bd_net -net MAYO_SIGNING_FSM_0_o_lin_coeffs_addr [get_bd_pins i_coeffs_addr] [get_bd_pins mayo_linear_combinat_0/i_coeffs_addr]
connect_bd_net -net MAYO_SIGNING_FSM_0_o_lin_out_addr [get_bd_pins i_out_addr] [get_bd_pins mayo_linear_combinat_0/i_out_addr]
connect_bd_net -net MAYO_SIGNING_FSM_0_o_lin_len [get_bd_pins i_len] [get_bd_pins mayo_linear_combinat_0/i_len]
connect_bd_net [get_bd_pins bram_sel] [get_bd_pins mayo_lin_comb_arbiter_0/bram_sel]

current_bd_instance /SmallBRAM
connect_bd_intf_net [get_bd_intf_pins BRAM_P1P1T] [get_bd_intf_pins mayo_bram_arbiter2_b/BRAM_P1P1T]
connect_bd_intf_net [get_bd_intf_pins BRAM_Add_oil] [get_bd_intf_pins mayo_bram_arbiter2_a/BRAM_Add_oil]
connect_bd_intf_net [get_bd_intf_pins BRAM_Sign] [get_bd_intf_pins mayo_bram_arbiter2_a/BRAM_Sign]
connect_bd_intf_net [get_bd_intf_pins BRAM_Red] [get_bd_intf_pins mayo_bram_arbiter2_a/BRAM_Red]
connect_bd_intf_net [get_bd_intf_pins BRAM_Hash] [get_bd_intf_pins mayo_bram_arbiter2_a/BRAM_Hash]
connect_bd_intf_net [get_bd_intf_pins BRAM_Sign1] [get_bd_intf_pins mayo_bram_arbiter2_b/BRAM_Sign]
connect_bd_intf_net [get_bd_intf_pins BRAM_Lin] [get_bd_intf_pins mayo_bram_arbiter2_a/BRAM_Lin]
connect_bd_intf_net [get_bd_intf_pins BRAM_Sam_vin] [get_bd_intf_pins mayo_bram_arbiter2_a/BRAM_Sam_vin]
connect_bd_intf_net [get_bd_intf_pins BRAM_Red_ext] [get_bd_intf_pins mayo_bram_arbiter2_a/BRAM_Red_ext]
connect_bd_intf_net [get_bd_intf_pins BRAM_Add_oil1] [get_bd_intf_pins mayo_bram_arbiter2_b/BRAM_Add_oil]
connect_bd_intf_net [get_bd_intf_pins BRAM_Sam_oil1] [get_bd_intf_pins mayo_bram_arbiter2_b/BRAM_Sam_oil]
connect_bd_intf_net [get_bd_intf_pins BRAM_Add_vec] [get_bd_intf_pins mayo_bram_arbiter2_a/BRAM_Add_vec]
connect_bd_intf_net [get_bd_intf_pins BRAM_Sam] [get_bd_intf_pins mayo_bram_arbiter2_a/BRAM_Sam]
connect_bd_intf_net [get_bd_intf_pins BRAM_Lin1] [get_bd_intf_pins mayo_bram_arbiter2_b/BRAM_Lin]
connect_bd_intf_net [get_bd_intf_pins BRAM_Red_ext1] [get_bd_intf_pins mayo_bram_arbiter2_b/BRAM_Red_ext]
connect_bd_intf_net [get_bd_intf_pins BRAM_Sam_oil] [get_bd_intf_pins mayo_bram_arbiter2_a/BRAM_Sam_oil]
connect_bd_net -net clk_0_1 [get_bd_pins clk_0] [get_bd_pins tdp_SmallBRAM_1_0/clka] [get_bd_pins tdp_SmallBRAM_1_0/clkb]
connect_bd_net -net BRAM_add_vec_din1_1 [get_bd_pins zero] \
  [get_bd_pins mayo_bram_arbiter2_a/BRAM_neg_din] [get_bd_pins mayo_bram_arbiter2_a/BRAM_neg_addr] \
  [get_bd_pins mayo_bram_arbiter2_a/BRAM_memcpy0_din] [get_bd_pins mayo_bram_arbiter2_a/BRAM_memcpy0_addr] \
  [get_bd_pins mayo_bram_arbiter2_a/BRAM_memcpy1_din] [get_bd_pins mayo_bram_arbiter2_a/BRAM_memcpy1_addr] \
  [get_bd_pins mayo_bram_arbiter2_a/BRAM_p1p1t_din] [get_bd_pins mayo_bram_arbiter2_a/BRAM_p1p1t_addr] \
  [get_bd_pins mayo_bram_arbiter2_b/BRAM_add_vec_din] [get_bd_pins mayo_bram_arbiter2_b/BRAM_add_vec_addr] \
  [get_bd_pins mayo_bram_arbiter2_b/BRAM_neg_din] [get_bd_pins mayo_bram_arbiter2_b/BRAM_neg_addr] \
  [get_bd_pins mayo_bram_arbiter2_b/BRAM_red_din] [get_bd_pins mayo_bram_arbiter2_b/BRAM_red_addr] \
  [get_bd_pins mayo_bram_arbiter2_b/BRAM_sam_din] [get_bd_pins mayo_bram_arbiter2_b/BRAM_sam_addr] \
  [get_bd_pins mayo_bram_arbiter2_b/BRAM_memcpy0_din] [get_bd_pins mayo_bram_arbiter2_b/BRAM_memcpy0_addr] \
  [get_bd_pins mayo_bram_arbiter2_b/BRAM_memcpy1_din] [get_bd_pins mayo_bram_arbiter2_b/BRAM_memcpy1_addr] \
  [get_bd_pins mayo_bram_arbiter2_b/BRAM_p1p1t_din] [get_bd_pins mayo_bram_arbiter2_b/BRAM_p1p1t_addr] \
  [get_bd_pins mayo_bram_arbiter2_b/BRAM_sam_vin_din] [get_bd_pins mayo_bram_arbiter2_b/BRAM_sam_vin_addr] \
  [get_bd_pins mayo_bram_arbiter2_b/BRAM_hash_din] [get_bd_pins mayo_bram_arbiter2_b/BRAM_hash_addr]
connect_bd_net -net BRAM_neg_we_1 [get_bd_pins zero4] \
  [get_bd_pins mayo_bram_arbiter2_a/BRAM_neg_we] [get_bd_pins mayo_bram_arbiter2_a/BRAM_memcpy0_we] \
  [get_bd_pins mayo_bram_arbiter2_a/BRAM_memcpy1_we] [get_bd_pins mayo_bram_arbiter2_a/BRAM_p1p1t_we] \
  [get_bd_pins mayo_bram_arbiter2_b/BRAM_add_vec_we] [get_bd_pins mayo_bram_arbiter2_b/BRAM_neg_we] \
  [get_bd_pins mayo_bram_arbiter2_b/BRAM_red_we] [get_bd_pins mayo_bram_arbiter2_b/BRAM_sam_we] \
  [get_bd_pins mayo_bram_arbiter2_b/BRAM_memcpy0_we] [get_bd_pins mayo_bram_arbiter2_b/BRAM_memcpy1_we] \
  [get_bd_pins mayo_bram_arbiter2_b/BRAM_p1p1t_we] [get_bd_pins mayo_bram_arbiter2_b/BRAM_sam_vin_we] \
  [get_bd_pins mayo_bram_arbiter2_b/BRAM_hash_we]
connect_bd_net -net BRAM_add_vec_en1_1 [get_bd_pins zero0] \
  [get_bd_pins mayo_bram_arbiter2_a/BRAM_neg_en] [get_bd_pins mayo_bram_arbiter2_a/BRAM_neg_rst] \
  [get_bd_pins mayo_bram_arbiter2_a/BRAM_neg_control] [get_bd_pins mayo_bram_arbiter2_a/BRAM_memcpy0_en] \
  [get_bd_pins mayo_bram_arbiter2_a/BRAM_memcpy0_rst] [get_bd_pins mayo_bram_arbiter2_a/BRAM_memcpy0_control] \
  [get_bd_pins mayo_bram_arbiter2_a/BRAM_memcpy1_en] [get_bd_pins mayo_bram_arbiter2_a/BRAM_memcpy1_rst] \
  [get_bd_pins mayo_bram_arbiter2_a/BRAM_memcpy1_control] [get_bd_pins mayo_bram_arbiter2_a/BRAM_p1p1t_en] \
  [get_bd_pins mayo_bram_arbiter2_a/BRAM_p1p1t_rst] [get_bd_pins mayo_bram_arbiter2_a/BRAM_p1p1t_control] \
  [get_bd_pins mayo_bram_arbiter2_b/BRAM_add_vec_en] [get_bd_pins mayo_bram_arbiter2_b/BRAM_add_vec_rst] \
  [get_bd_pins mayo_bram_arbiter2_b/BRAM_add_vec_control] [get_bd_pins mayo_bram_arbiter2_b/BRAM_neg_en] \
  [get_bd_pins mayo_bram_arbiter2_b/BRAM_neg_rst] [get_bd_pins mayo_bram_arbiter2_b/BRAM_neg_control] \
  [get_bd_pins mayo_bram_arbiter2_b/BRAM_red_en] [get_bd_pins mayo_bram_arbiter2_b/BRAM_red_rst] \
  [get_bd_pins mayo_bram_arbiter2_b/BRAM_red_control] [get_bd_pins mayo_bram_arbiter2_b/BRAM_sam_en] \
  [get_bd_pins mayo_bram_arbiter2_b/BRAM_sam_rst] [get_bd_pins mayo_bram_arbiter2_b/BRAM_sam_control] \
  [get_bd_pins mayo_bram_arbiter2_b/BRAM_memcpy0_en] [get_bd_pins mayo_bram_arbiter2_b/BRAM_memcpy0_rst] \
  [get_bd_pins mayo_bram_arbiter2_b/BRAM_memcpy0_control] [get_bd_pins mayo_bram_arbiter2_b/BRAM_memcpy1_en] \
  [get_bd_pins mayo_bram_arbiter2_b/BRAM_memcpy1_rst] [get_bd_pins mayo_bram_arbiter2_b/BRAM_memcpy1_control] \
  [get_bd_pins mayo_bram_arbiter2_b/BRAM_sam_vin_en] [get_bd_pins mayo_bram_arbiter2_b/BRAM_sam_vin_rst] \
  [get_bd_pins mayo_bram_arbiter2_b/BRAM_sam_vin_control] [get_bd_pins mayo_bram_arbiter2_b/BRAM_hash_en] \
  [get_bd_pins mayo_bram_arbiter2_b/BRAM_hash_rst] [get_bd_pins mayo_bram_arbiter2_b/BRAM_hash_control] \
  [get_bd_pins tdp_SmallBRAM_1_0/regcea] [get_bd_pins tdp_SmallBRAM_1_0/regceb]
connect_bd_net [get_bd_pins mayo_bram_arbiter2_a/BRAM_en] [get_bd_pins tdp_SmallBRAM_1_0/ena]
connect_bd_net [get_bd_pins tdp_SmallBRAM_1_0/douta] [get_bd_pins mayo_bram_arbiter2_a/BRAM_dout]
connect_bd_net [get_bd_pins mayo_bram_arbiter2_a/BRAM_din] [get_bd_pins tdp_SmallBRAM_1_0/dina]
connect_bd_net [get_bd_pins mayo_bram_arbiter2_a/BRAM_we] [get_bd_pins tdp_SmallBRAM_1_0/wea]
connect_bd_net [get_bd_pins mayo_bram_arbiter2_a/BRAM_addr] [get_bd_pins tdp_SmallBRAM_1_0/addra]
connect_bd_net [get_bd_pins mayo_bram_arbiter2_a/BRAM_rst] [get_bd_pins tdp_SmallBRAM_1_0/rsta]
connect_bd_net [get_bd_pins mayo_bram_arbiter2_b/BRAM_en] [get_bd_pins tdp_SmallBRAM_1_0/enb]
connect_bd_net [get_bd_pins tdp_SmallBRAM_1_0/doutb] [get_bd_pins mayo_bram_arbiter2_b/BRAM_dout]
connect_bd_net [get_bd_pins mayo_bram_arbiter2_b/BRAM_din] [get_bd_pins tdp_SmallBRAM_1_0/dinb]
connect_bd_net [get_bd_pins mayo_bram_arbiter2_b/BRAM_we] [get_bd_pins tdp_SmallBRAM_1_0/web]
connect_bd_net [get_bd_pins mayo_bram_arbiter2_b/BRAM_addr] [get_bd_pins tdp_SmallBRAM_1_0/addrb]
connect_bd_net [get_bd_pins mayo_bram_arbiter2_b/BRAM_rst] [get_bd_pins tdp_SmallBRAM_1_0/rstb]

current_bd_instance /TRNG
connect_bd_net [get_bd_pins i_trng_sel1] [get_bd_pins xlconcat_0/In0]
connect_bd_net -net In1_1 [get_bd_pins i_trng_sel2] [get_bd_pins xlconcat_0/In1]
connect_bd_net [get_bd_pins xlconcat_0/dout] [get_bd_pins mayo_trng_arbiter_0/i_trng_sel]
connect_bd_net -net i_trng0_en_0_1 [get_bd_pins i_trng0_en_0] [get_bd_pins mayo_trng_arbiter_0/i_trng0_en]
connect_bd_net -net i_trng1_en_0_1 [get_bd_pins i_trng1_en_0] [get_bd_pins mayo_trng_arbiter_0/i_trng1_en]
connect_bd_net -net i_trng2_en_0_1 [get_bd_pins i_trng2_en_0] [get_bd_pins mayo_trng_arbiter_0/i_trng2_en]
connect_bd_net [get_bd_pins mayo_trng_arbiter_0/o_trng0_random_data] [get_bd_pins o_trng0_random_data_0]
connect_bd_net [get_bd_pins mayo_trng_arbiter_0/o_trng0_valid] [get_bd_pins o_trng0_valid_0]
connect_bd_net [get_bd_pins mayo_trng_arbiter_0/o_trng1_random_data] [get_bd_pins o_trng1_random_data_0]
connect_bd_net [get_bd_pins mayo_trng_arbiter_0/o_trng1_valid] [get_bd_pins o_trng1_valid_0]
connect_bd_net [get_bd_pins mayo_trng_arbiter_0/o_trng2_random_data] [get_bd_pins o_trng2_random_data_0]
connect_bd_net [get_bd_pins mayo_trng_arbiter_0/o_trng2_valid] [get_bd_pins o_trng2_valid_0]
connect_bd_net [get_bd_pins clk] [get_bd_pins aes_128_ctr_0/clk]
connect_bd_net [get_bd_pins rst] [get_bd_pins aes_128_ctr_0/rst]
connect_bd_net [get_bd_pins mayo_trng_arbiter_0/o_trng_en] [get_bd_pins aes_128_ctr_0/en]
connect_bd_net [get_bd_pins aes_128_ctr_0/o_valid] [get_bd_pins mayo_trng_arbiter_0/i_trng_valid]
connect_bd_net [get_bd_pins aes_128_ctr_0/o_random_data] [get_bd_pins mayo_trng_arbiter_0/i_trng_random_data]

current_bd_instance /add_vectors
connect_bd_intf_net [get_bd_intf_pins mayo_add_vectors_0/BRAM_Add_VecC] [get_bd_intf_pins mayo_add_vectors_arb_0/BRAM_I_AddC]
connect_bd_intf_net [get_bd_intf_pins BRAM_O_Add2B] [get_bd_intf_pins mayo_add_vectors_arb_0/BRAM_O_Add2B]
connect_bd_intf_net [get_bd_intf_pins mayo_add_vectors_0/BRAM_Add_VecA] [get_bd_intf_pins mayo_add_vectors_arb_0/BRAM_I_AddA]
connect_bd_intf_net [get_bd_intf_pins BRAM_O_Add2A] [get_bd_intf_pins mayo_add_vectors_arb_0/BRAM_O_Add2A]
connect_bd_intf_net [get_bd_intf_pins BRAM_O_Add1A] [get_bd_intf_pins mayo_add_vectors_arb_0/BRAM_O_Add1A]
connect_bd_intf_net [get_bd_intf_pins mayo_add_vectors_0/BRAM_Add_VecB] [get_bd_intf_pins mayo_add_vectors_arb_0/BRAM_I_AddB]
connect_bd_intf_net [get_bd_intf_pins BRAM_O_Add0A] [get_bd_intf_pins mayo_add_vectors_arb_0/BRAM_O_Add0A]
connect_bd_net -net clk_0_1 [get_bd_pins clk_0] [get_bd_pins mayo_add_vectors_0/i_clk]
connect_bd_net -net rst_0_1 [get_bd_pins rst_0] [get_bd_pins mayo_add_vectors_0/rst]
connect_bd_net -net MAYO_SIGNING_FSM_0_o_add_enable [get_bd_pins i_enable] [get_bd_pins mayo_add_vectors_0/i_enable]
connect_bd_net -net MAYO_SIGNING_FSM_0_o_add_v1_addr [get_bd_pins i_v1_addr] [get_bd_pins mayo_add_vectors_0/i_v1_addr]
connect_bd_net -net MAYO_SIGNING_FSM_0_o_add_v2_addr [get_bd_pins i_v2_addr] [get_bd_pins mayo_add_vectors_0/i_v2_addr]
connect_bd_net -net MAYO_SIGNING_FSM_0_o_add_out_addr [get_bd_pins i_out_addr] [get_bd_pins mayo_add_vectors_0/i_out_addr]
connect_bd_net -net MAYO_SIGNING_FSM_0_o_add_bram_sel [get_bd_pins i_bram_sel] [get_bd_pins mayo_add_vectors_0/i_bram_sel]
connect_bd_net [get_bd_pins mayo_add_vectors_0/o_done] [get_bd_pins o_done]
connect_bd_net [get_bd_pins bram_sel] [get_bd_pins mayo_add_vectors_arb_0/bram_sel]

current_bd_instance /hash
connect_bd_intf_net [get_bd_intf_pins BRAM_HashBig] [get_bd_intf_pins mayo_hash_bram_arbit_0/BRAM_HashBig]
connect_bd_intf_net [get_bd_intf_pins BRAM_HashSmall] [get_bd_intf_pins mayo_hash_bram_arbit_0/BRAM_HashSmall]
connect_bd_net [get_bd_pins bram_sel] [get_bd_pins mayo_hash_bram_arbit_0/bram_sel]
connect_bd_net [get_bd_pins clk] [get_bd_pins shake_128_0/clk]
connect_bd_net [get_bd_pins rst] [get_bd_pins shake_128_0/rst]
connect_bd_net [get_bd_pins shake_128_0/bram_control] [get_bd_pins mayo_hash_bram_arbit_0/hash_control]
connect_bd_net [get_bd_pins shake_128_0/bram_en] [get_bd_pins mayo_hash_bram_arbit_0/hash_en]
connect_bd_net [get_bd_pins mayo_hash_bram_arbit_0/hash_dout] [get_bd_pins shake_128_0/bram_dout]
connect_bd_net [get_bd_pins shake_128_0/bram_din] [get_bd_pins mayo_hash_bram_arbit_0/hash_din]
connect_bd_net [get_bd_pins shake_128_0/bram_we] [get_bd_pins mayo_hash_bram_arbit_0/hash_we]
connect_bd_net [get_bd_pins shake_128_0/bram_addr] [get_bd_pins mayo_hash_bram_arbit_0/hash_addr]
connect_bd_net [get_bd_pins shake_128_0/done] [get_bd_pins o_key_done]
connect_bd_net [get_bd_pins xlconstant_0/dout] [get_bd_pins o_key_dyn_done]
connect_bd_net [get_bd_pins i_key_mlen] [get_bd_pins shake_128_0/mlen]
connect_bd_net [get_bd_pins i_key_en] [get_bd_pins shake_128_0/en]
connect_bd_net [get_bd_pins i_key_olen] [get_bd_pins shake_128_0/olen]
connect_bd_net [get_bd_pins i_key_write_adr] [get_bd_pins shake_128_0/write_adr]
connect_bd_net [get_bd_pins i_key_read_adr] [get_bd_pins shake_128_0/read_adr]

current_bd_instance /
connect_bd_intf_net [get_bd_intf_pins hash/BRAM_HashSmall] [get_bd_intf_pins SmallBRAM/BRAM_Hash]
connect_bd_intf_net [get_bd_intf_pins MAYO_SIGNING_FSM_0/BRAM_Sign0b] [get_bd_intf_pins SmallBRAM/BRAM_Sign1]
connect_bd_intf_net [get_bd_intf_pins mayo_add_oil_0/BRAM_Add_oil0a] [get_bd_intf_pins SmallBRAM/BRAM_Add_oil]
connect_bd_intf_net [get_bd_intf_pins MAYO_P1P1T_0/BRAM_P1P1T2a] [get_bd_intf_pins BigBRAM2/BRAM_P1P1T]
connect_bd_intf_net [get_bd_intf_pins mayo_sample_oil_space_0/BRAM_Sama] [get_bd_intf_pins SmallBRAM/BRAM_Sam]
connect_bd_intf_net [get_bd_intf_pins mayo_negate_0/BRAM_Negate] [get_bd_intf_pins BigBRAM2/BRAM_Neg]
connect_bd_intf_net [get_bd_intf_pins mayo_reduce_extension_0/BRAM_Red_Extb] [get_bd_intf_pins SmallBRAM/BRAM_Red_ext1]
connect_bd_intf_net [get_bd_intf_pins MAYO_SIGNING_FSM_0/BRAM_Sign1a] [get_bd_intf_pins BigBRAM1/BRAM_Sign]
connect_bd_intf_net [get_bd_intf_pins mayo_sample_oil_0/BRAM_Sample_oil0b] [get_bd_intf_pins SmallBRAM/BRAM_Sam_oil1]
connect_bd_intf_net [get_bd_intf_pins hash/BRAM_HashBig] [get_bd_intf_pins BigBRAM1/BRAM_Hash]
connect_bd_intf_net [get_bd_intf_pins mayo_sample_vinegar_0/BRAM_Sam_vin0a] [get_bd_intf_pins SmallBRAM/BRAM_Sam_vin]
connect_bd_intf_net [get_bd_intf_pins MAYO_SIGNING_FSM_0/BRAM_Sign2b] [get_bd_intf_pins BigBRAM2/BRAM_Sign]
connect_bd_intf_net [get_bd_intf_pins LInear_Combination/BRAM_O_LinArb1a] [get_bd_intf_pins BigBRAM1/BRAM_Lin]
connect_bd_intf_net [get_bd_intf_pins memcpy_0/BRAM_Dest_PORTB] [get_bd_intf_pins BigBRAM1/BRAM_Memcpy0]
connect_bd_intf_net [get_bd_intf_pins mayo_reduce_extension_0/BRAM_Red_Extc] [get_bd_intf_pins BigBRAM2/BRAM_Red_ext1]
connect_bd_intf_net [get_bd_intf_pins processing_system7_0/M_AXI_GP0] [get_bd_intf_pins ps7_0_axi_periph/S00_AXI]
connect_bd_intf_net [get_bd_intf_ports DDR] [get_bd_intf_pins processing_system7_0/DDR]
connect_bd_intf_net [get_bd_intf_pins mayo_reduce_0/BRAM_Red1] [get_bd_intf_pins BigBRAM1/BRAM_Red]
connect_bd_intf_net [get_bd_intf_pins MAYO_SIGNING_FSM_0/BRAM_Sign2a] [get_bd_intf_pins BigBRAM2/BRAM_Sign1]
connect_bd_intf_net [get_bd_intf_pins mayo_reduce_0/BRAM_Red0] [get_bd_intf_pins SmallBRAM/BRAM_Red]
connect_bd_intf_net [get_bd_intf_pins SmallBRAM/BRAM_Lin] [get_bd_intf_pins LInear_Combination/BRAM_O_LinArb0a]
connect_bd_intf_net [get_bd_intf_pins add_vectors/BRAM_O_Add2A] [get_bd_intf_pins BigBRAM2/BRAM_Add_vec]
connect_bd_intf_net [get_bd_intf_pins MAYO_P1P1T_0/BRAM_P1P1T1b] [get_bd_intf_pins BigBRAM1/BRAM_P1P1T]
connect_bd_intf_net [get_bd_intf_pins LInear_Combination/BRAM_O_LinArb2b] [get_bd_intf_pins BigBRAM2/BRAM_Lin1]
connect_bd_intf_net [get_bd_intf_pins mayo_sample_oil_0/BRAM_Sample_oil1a] [get_bd_intf_pins BigBRAM1/BRAM_Sam_oil]
connect_bd_intf_net [get_bd_intf_pins ps7_0_axi_periph/M00_AXI] [get_bd_intf_pins mayo_axi_litev3_0/S00_AXI]
connect_bd_intf_net [get_bd_intf_pins LInear_Combination/BRAM_O_LinArb2a] [get_bd_intf_pins BigBRAM2/BRAM_Lin]
connect_bd_intf_net [get_bd_intf_pins SmallBRAM/BRAM_Sign] [get_bd_intf_pins MAYO_SIGNING_FSM_0/BRAM_Sign0a]
connect_bd_intf_net [get_bd_intf_pins memcpy_0/BRAM_Src_PORTA] [get_bd_intf_pins BigBRAM2/BRAM_Memcpy0]
connect_bd_intf_net [get_bd_intf_pins mayo_sample_oil_space_0/BRAM_Samb] [get_bd_intf_pins BigBRAM1/BRAM_Sam]
connect_bd_intf_net [get_bd_intf_pins mayo_add_oil_0/BRAM_Add_oil1a] [get_bd_intf_pins BigBRAM1/BRAM_Add_oil]
connect_bd_intf_net [get_bd_intf_pins mayo_sample_oil_0/BRAM_Sample_oil0a] [get_bd_intf_pins SmallBRAM/BRAM_Sam_oil]
connect_bd_intf_net [get_bd_intf_pins SmallBRAM/BRAM_Add_vec] [get_bd_intf_pins add_vectors/BRAM_O_Add0A]
connect_bd_intf_net [get_bd_intf_pins ps7_0_axi_periph/M01_AXI] [get_bd_intf_pins axi_bram_ctrl_0/S_AXI]
connect_bd_intf_net [get_bd_intf_pins mayo_reduce_extension_0/BRAM_Red_Exta] [get_bd_intf_pins SmallBRAM/BRAM_Red_ext]
connect_bd_intf_net [get_bd_intf_pins add_vectors/BRAM_O_Add1A] [get_bd_intf_pins BigBRAM1/BRAM_Add_vec]
connect_bd_intf_net [get_bd_intf_pins SmallBRAM/BRAM_Lin1] [get_bd_intf_pins LInear_Combination/BRAM_O_LinArb0b]
connect_bd_intf_net [get_bd_intf_pins add_vectors/BRAM_O_Add2B] [get_bd_intf_pins BigBRAM2/BRAM_Add_vec1]
connect_bd_intf_net [get_bd_intf_ports FIXED_IO] [get_bd_intf_pins processing_system7_0/FIXED_IO]
connect_bd_intf_net [get_bd_intf_pins mayo_add_oil_0/BRAM_Add_oil0b] [get_bd_intf_pins SmallBRAM/BRAM_Add_oil1]
connect_bd_intf_net [get_bd_intf_pins memcpy_1/BRAM_Src_PORTA] [get_bd_intf_pins BigBRAM1/BRAM_Memcpy1]
connect_bd_net [get_bd_pins Ground0/dout] \
  [get_bd_pins mayo_axi_litev3_0/i_Keygen_done] [get_bd_pins mayo_axi_litev3_0/i_Verification_done] \
  [get_bd_pins mayo_axi_litev3_0/i_Keygen_busy] [get_bd_pins mayo_axi_litev3_0/i_Verification_busy]
connect_bd_net [get_bd_pins processing_system7_0/FCLK_CLK0] \
  [get_bd_pins processing_system7_0/M_AXI_GP0_ACLK] [get_bd_pins ps7_0_axi_periph/S00_ACLK] \
  [get_bd_pins rst_ps7_0_100M/slowest_sync_clk] [get_bd_pins mayo_axi_litev3_0/s00_axi_aclk] \
  [get_bd_pins ps7_0_axi_periph/M00_ACLK] [get_bd_pins ps7_0_axi_periph/ACLK] [get_bd_pins ps7_0_axi_periph/M01_ACLK] \
  [get_bd_pins TRNG/clk] [get_bd_pins hash/clk] [get_bd_pins SmallBRAM/clk_0] [get_bd_pins BigBRAM1/clk_0] \
  [get_bd_pins LInear_Combination/clk_0] [get_bd_pins add_vectors/clk_0] [get_bd_pins BigBRAM2/clk] \
  [get_bd_pins MAYO_P1P1T_0/clk] [get_bd_pins mayo_add_oil_0/clk] [get_bd_pins mayo_negate_0/i_clk] \
  [get_bd_pins mayo_reduce_0/i_clk] [get_bd_pins mayo_reduce_extension_0/clk] [get_bd_pins memcpy_0/clk] \
  [get_bd_pins memcpy_1/clk] [get_bd_pins MAYO_SIGNING_FSM_0/clk] [get_bd_pins mayo_sample_oil_0/clk] \
  [get_bd_pins mayo_sample_oil_space_0/i_clk] [get_bd_pins axi_bram_ctrl_0/s_axi_aclk] \
  [get_bd_pins mayo_sample_vinegar_0/clk]
connect_bd_net [get_bd_pins processing_system7_0/FCLK_RESET0_N] [get_bd_pins rst_ps7_0_100M/ext_reset_in]
connect_bd_net [get_bd_pins rst_ps7_0_100M/peripheral_aresetn] \
  [get_bd_pins ps7_0_axi_periph/S00_ARESETN] [get_bd_pins mayo_axi_litev3_0/s00_axi_aresetn] \
  [get_bd_pins ps7_0_axi_periph/M00_ARESETN] [get_bd_pins ps7_0_axi_periph/ARESETN] \
  [get_bd_pins ps7_0_axi_periph/M01_ARESETN] [get_bd_pins axi_bram_ctrl_0/s_axi_aresetn]
connect_bd_net [get_bd_pins xlconcat_0/dout] [get_bd_pins mayo_axi_litev3_0/i_error]
connect_bd_net [get_bd_pins xlconstant_0/dout] [get_bd_pins xlconcat_0/In1]
connect_bd_net [get_bd_pins mayo_axi_litev3_0/o_interrupt] [get_bd_pins processing_system7_0/IRQ_F2P]
connect_bd_net -net Ground0_dout1 [get_bd_pins Ground1/dout] [get_bd_pins BigBRAM1/zero0] [get_bd_pins SmallBRAM/zero0] [get_bd_pins BigBRAM2/Zero0]
connect_bd_net [get_bd_pins Ground32/dout] [get_bd_pins BigBRAM1/zero32] [get_bd_pins SmallBRAM/zero] [get_bd_pins BigBRAM2/Zero32]
connect_bd_net [get_bd_pins Ground4/dout] [get_bd_pins BigBRAM1/zero4] [get_bd_pins SmallBRAM/zero4] [get_bd_pins BigBRAM2/Zero4]
connect_bd_net [get_bd_pins MAYO_P1P1T_0/o_done] [get_bd_pins MAYO_SIGNING_FSM_0/i_p1p1t_done]
connect_bd_net [get_bd_pins MAYO_SIGNING_FSM_0/o_add_bram_sel] [get_bd_pins add_vectors/i_bram_sel]
connect_bd_net [get_bd_pins MAYO_SIGNING_FSM_0/o_add_demux_bram_sel] [get_bd_pins add_vectors/bram_sel]
connect_bd_net [get_bd_pins MAYO_SIGNING_FSM_0/o_add_enable] [get_bd_pins add_vectors/i_enable]
connect_bd_net [get_bd_pins MAYO_SIGNING_FSM_0/o_add_oil_enable] [get_bd_pins mayo_add_oil_0/i_enable]
connect_bd_net [get_bd_pins MAYO_SIGNING_FSM_0/o_add_out_addr] [get_bd_pins add_vectors/i_out_addr]
connect_bd_net [get_bd_pins MAYO_SIGNING_FSM_0/o_add_v1_addr] [get_bd_pins add_vectors/i_v1_addr]
connect_bd_net [get_bd_pins MAYO_SIGNING_FSM_0/o_add_v2_addr] [get_bd_pins add_vectors/i_v2_addr]
connect_bd_net [get_bd_pins MAYO_SIGNING_FSM_0/o_hash_en] [get_bd_pins hash/i_key_en]
connect_bd_net [get_bd_pins MAYO_SIGNING_FSM_0/o_hash_memsel] [get_bd_pins hash/bram_sel]
connect_bd_net [get_bd_pins MAYO_SIGNING_FSM_0/o_hash_mlen] [get_bd_pins hash/i_key_mlen]
connect_bd_net [get_bd_pins MAYO_SIGNING_FSM_0/o_hash_olen] [get_bd_pins hash/i_key_olen]
connect_bd_net [get_bd_pins MAYO_SIGNING_FSM_0/o_hash_read_adr] [get_bd_pins hash/i_key_read_adr]
connect_bd_net [get_bd_pins MAYO_SIGNING_FSM_0/o_hash_write_adr] [get_bd_pins hash/i_key_write_adr]
connect_bd_net [get_bd_pins MAYO_SIGNING_FSM_0/o_lin_bram_halt] [get_bd_pins LInear_Combination/i_bram_halt]
connect_bd_net [get_bd_pins MAYO_SIGNING_FSM_0/o_lin_coeffs_addr] [get_bd_pins LInear_Combination/i_coeffs_addr]
connect_bd_net [get_bd_pins MAYO_SIGNING_FSM_0/o_lin_demux_bram_sel] [get_bd_pins LInear_Combination/bram_sel]
connect_bd_net [get_bd_pins MAYO_SIGNING_FSM_0/o_lin_enable] [get_bd_pins LInear_Combination/i_enable]
connect_bd_net [get_bd_pins MAYO_SIGNING_FSM_0/o_lin_len] [get_bd_pins LInear_Combination/i_len]
connect_bd_net [get_bd_pins MAYO_SIGNING_FSM_0/o_lin_out_addr] [get_bd_pins LInear_Combination/i_out_addr]
connect_bd_net [get_bd_pins MAYO_SIGNING_FSM_0/o_lin_vec_addr] [get_bd_pins LInear_Combination/i_vec_addr]
connect_bd_net [get_bd_pins MAYO_SIGNING_FSM_0/o_memcpy1_dst_adr] [get_bd_pins memcpy_1/i_dst_adr]
connect_bd_net [get_bd_pins MAYO_SIGNING_FSM_0/o_memcpy1_len] [get_bd_pins memcpy_1/i_len]
connect_bd_net [get_bd_pins MAYO_SIGNING_FSM_0/o_memcpy1_mem_port_sel] [get_bd_pins memcpy_1/i_mem_port_sel]
connect_bd_net [get_bd_pins MAYO_SIGNING_FSM_0/o_memcpy1_src_adr] [get_bd_pins memcpy_1/i_src_adr]
connect_bd_net [get_bd_pins MAYO_SIGNING_FSM_0/o_memcpy1_start] [get_bd_pins memcpy_1/start]
connect_bd_net [get_bd_pins MAYO_SIGNING_FSM_0/o_memcpy_dst_adr] [get_bd_pins memcpy_0/i_dst_adr]
connect_bd_net [get_bd_pins MAYO_SIGNING_FSM_0/o_memcpy_len] [get_bd_pins memcpy_0/i_len]
connect_bd_net [get_bd_pins MAYO_SIGNING_FSM_0/o_memcpy_mem_port_sel] [get_bd_pins memcpy_0/i_mem_port_sel]
connect_bd_net [get_bd_pins MAYO_SIGNING_FSM_0/o_memcpy_src_adr] [get_bd_pins memcpy_0/i_src_adr]
connect_bd_net [get_bd_pins MAYO_SIGNING_FSM_0/o_memcpy_start] [get_bd_pins memcpy_0/start]
connect_bd_net [get_bd_pins MAYO_SIGNING_FSM_0/o_neg_adr] [get_bd_pins mayo_negate_0/i_adr]
connect_bd_net [get_bd_pins MAYO_SIGNING_FSM_0/o_neg_enable] [get_bd_pins mayo_negate_0/i_enable]
connect_bd_net [get_bd_pins MAYO_SIGNING_FSM_0/o_neg_len] [get_bd_pins mayo_negate_0/i_len]
connect_bd_net [get_bd_pins MAYO_SIGNING_FSM_0/o_p1p1t_dsta_adr] [get_bd_pins MAYO_P1P1T_0/i_dsta_adr]
connect_bd_net [get_bd_pins MAYO_SIGNING_FSM_0/o_p1p1t_dstb_adr] [get_bd_pins MAYO_P1P1T_0/i_dstb_adr]
connect_bd_net [get_bd_pins MAYO_SIGNING_FSM_0/o_p1p1t_enable] [get_bd_pins MAYO_P1P1T_0/enable]
